# Altium schematic sheet CH32X035G8U6-R0.SchDoc
size 304 x 254 mm
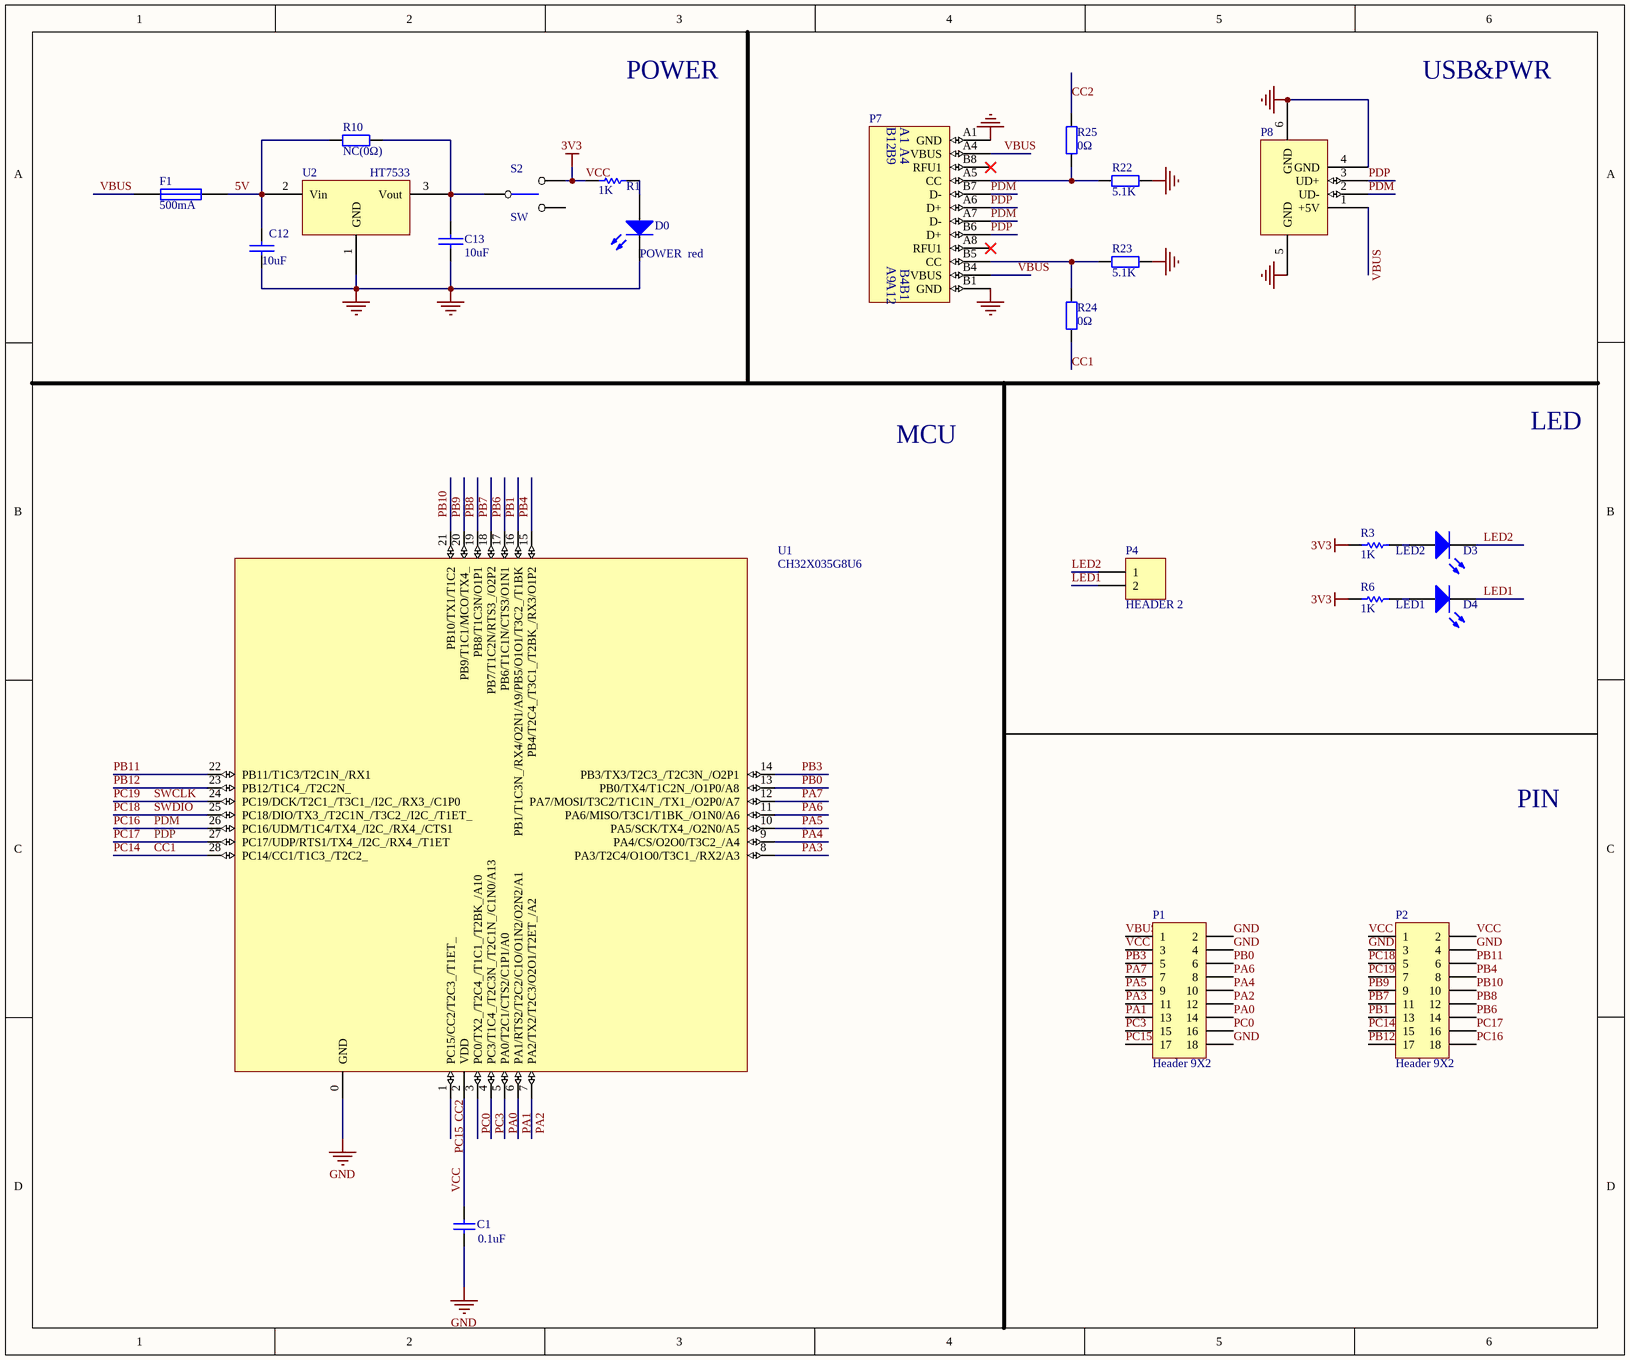
[diagram p0: CH32X035G8U6-R0.SchDoc]

## Parts
C1  0.1uF  [0603_C]
C12  10uF  [0603_C]
C13  10uF  [0603_C]
D0  POWER  red  [0603+]
D3  LED2  [0603+]
D4  LED1  [0603+]
F1  500mA  [0603]
P1  Header 9X2  [IDC18-2.54mm]
P2  Header 9X2  [IDC18-2.54mm]
P4  HEADER 2  [SIP2-2.54mm]
P7  TYPE-C  [TYPE-C-Receptacle-2.0]  (value not drawn)
P8  USB_A  [USBAF]  (value not drawn)
R1  1K  [0603]
R3  1K  [0603]
R6  1K  [0603]
R10  NC(0Ω)  [0603]
R22  5.1K  [0603]
R23  5.1K  [0603]
R24  0Ω  [0603]
R25  0Ω  [0603]
S2  SW  [SW1]
U1  CH32X035G8U6  [QFN28_4X4]
U2  HT7533  [SOT-89]

## Nets
GND: C1.1 C12.2 C13.2 D0.2(K) P1.2 P1.4 P1.18 P2.3 P2.4 P7.A1(GND) P7.B1(GND) P8.4(GND) P8.5(GND) P8.6(GND) R22.2 R23.2 U1.0(GND) U2.1(GND)
VCC: C1.2 P1.3 P2.1 P2.2 R1.2 R3.1 R6.1 S2.3 U1.2(VDD)  [also labelled 3V3]
5V: C12.1 F1.2 R10.2 U2.2(Vin)
CC1: P2.15 R24.1 U1.28(PC14/CC1/T1C3_/T2C2_)  [also labelled PC14]
CC2: P1.17 R25.2 U1.1(PC15/CC2/T2C3_/T1ET_)  [also labelled PC15]
LED1: D4.2(K) P4.2
LED2: D3.2(K) P4.1
PA0: P1.14 U1.5(PA0/T2C1/CTS2/C1P1/A0)
PA1: P1.13 U1.6(PA1/RTS2/T2C2/C1O/O1N2/O2N2/A1)
PA2: P1.12 U1.7(PA2/TX2/T2C3/O2O1/T2ET_/A2)
PA3: P1.11 U1.8(PA3/T2C4/O1O0/T3C1_/RX2/A3)
PA4: P1.10 U1.9(PA4/CS/O2O0/T3C2_/A4)
PA5: P1.9 U1.10(PA5/SCK/TX4_/O2N0/A5)
PA6: P1.8 U1.11(PA6/MISO/T3C1/T1BK_/O1N0/A6)
PA7: P1.7 U1.12(PA7/MOSI/T3C2/T1C1N_/TX1_/O2P0/A7)
PB0: P1.6 U1.13(PB0/TX4/T1C2N_/O1P0/A8)
PB1: P2.13 U1.16(PB1/T1C3N_/RX4/O2N1/A9/PB5/O1O1/T3C2_/T1BK)
PB3: P1.5 U1.14(PB3/TX3/T2C3_/T2C3N_/O2P1)
PB4: P2.8 U1.15(PB4/T2C4_/T3C1_/T2BK_/RX3/O1P2)
PB6: P2.14 U1.17(PB6/T1C1N/CTS3/O1N1)
PB7: P2.11 U1.18(PB7/T1C2N/RTS3_/O2P2)
PB8: P2.12 U1.19(PB8/T1C3N/O1P1)
PB9: P2.9 U1.20(PB9/T1C1/MCO/TX4_)
PB10: P2.10 U1.21(PB10/TX1/T1C2)
PB11: P2.6 U1.22(PB11/T1C3/T2C1N_/RX1)
PB12: P2.17 U1.23(PB12/T1C4_/T2C2N_)
PC0: P1.16 U1.3(PC0/TX2_/T2C4_/T1C1_/T2BK_/A10)
PC3: P1.15 U1.4(PC3/T1C4_/T2C3N_/T2C1N_/C1N0/A13)
PC16: P2.18 P7.A7(D-) P7.B7(D-) P8.2(UD-) U1.26(PC16/UDM/T1C4/TX4_/I2C_/RX4_/CTS1)  [also labelled PDM]
PC17: P2.16 P7.A6(D+) P7.B6(D+) P8.3(UD+) U1.27(PC17/UDP/RTS1/TX4_/I2C_/RX4_/T1ET)  [also labelled PDP]
PC18: P2.5 U1.25(PC18/DIO/TX3_/T2C1N_/T3C2_/I2C_/T1ET_)  [also labelled SWDIO]
PC19: P2.7 U1.24(PC19/DCK/T2C1_/T3C1_/I2C_/RX3_/C1P0)  [also labelled SWCLK]
VBUS: F1.1 P1.1 P7.A4(VBUS) P7.B4(VBUS) P8.1(+5V)
NetC13_1: C13.1 R10.1 S2.1 U2.3(Vout)
NetD0_1: D0.1(A) R1.1
NetD3_1: D3.1(A) R3.2
NetD4_1: D4.1(A) R6.2
NetP7_A5: P7.A5(CC) R22.1 R25.1
NetP7_B5: P7.B5(CC) R23.1 R24.2

Not connected (* = marked no-connect by the designer): P7 A8(RFU1)* B8(RFU1)*; S2 2

## Notes on the sheet
- POWER
- USB&PWR
- LED
- MCU
- PIN
- (in symbol TYPE-C1) B12; B9; A9; A12

## Library data of the parts
C1 = Cap: Capacitor
C12 C13 = CAP: Capacitor
D0 D3 D4 = LED0: Typical INFRARED GaAs LED; Published: 8-Jun-2000; LatestRevisionDate: 08-Jul-2005; LatestRevisionNote: Mech Layer 1 removed.; PackageReference: LED-0; Publisher: Altium Limited
F1 = FUSE1: Fuse
P1 P2 = Header 9X2: Header, 9-Pin, Dual row; LatestRevisionDate: 17-Jul-2002; LatestRevisionNote: Re-released for DXP Platform.; Publisher: Altium Limited
P4 = HEADER 2: Header, 2-Pin
P7 = TYPE-C1
P8 = USB: USB Port
R1 R3 R6 = Res Semi: Semiconductor Resistor; Published: 8-Jun-2000; LatestRevisionDate: 17-Jul-2002; LatestRevisionNote: Re-released for DXP Platform.; PackageReference: AXIAL-0.5; Publisher: Altium Limited; Value: 1K
R10 = Res2: Resistor; Value: 10K; Published: 8-Jun-2000; LatestRevisionDate: 17-Jul-2002; LatestRevisionNote: Re-released for DXP Platform.; PackageReference: AXIAL-0.4; Publisher: Altium Limited
R22-R25 = Res2: Resistor
U1 = CH32X035G8U6: RISC-V MCU with USB/PD/ADC/SPI/I2C/UART/OA/CMP
U2 = 1117-3.3V